# EAGLE design SolderIron2.0 (EAGLE 7.4.0)
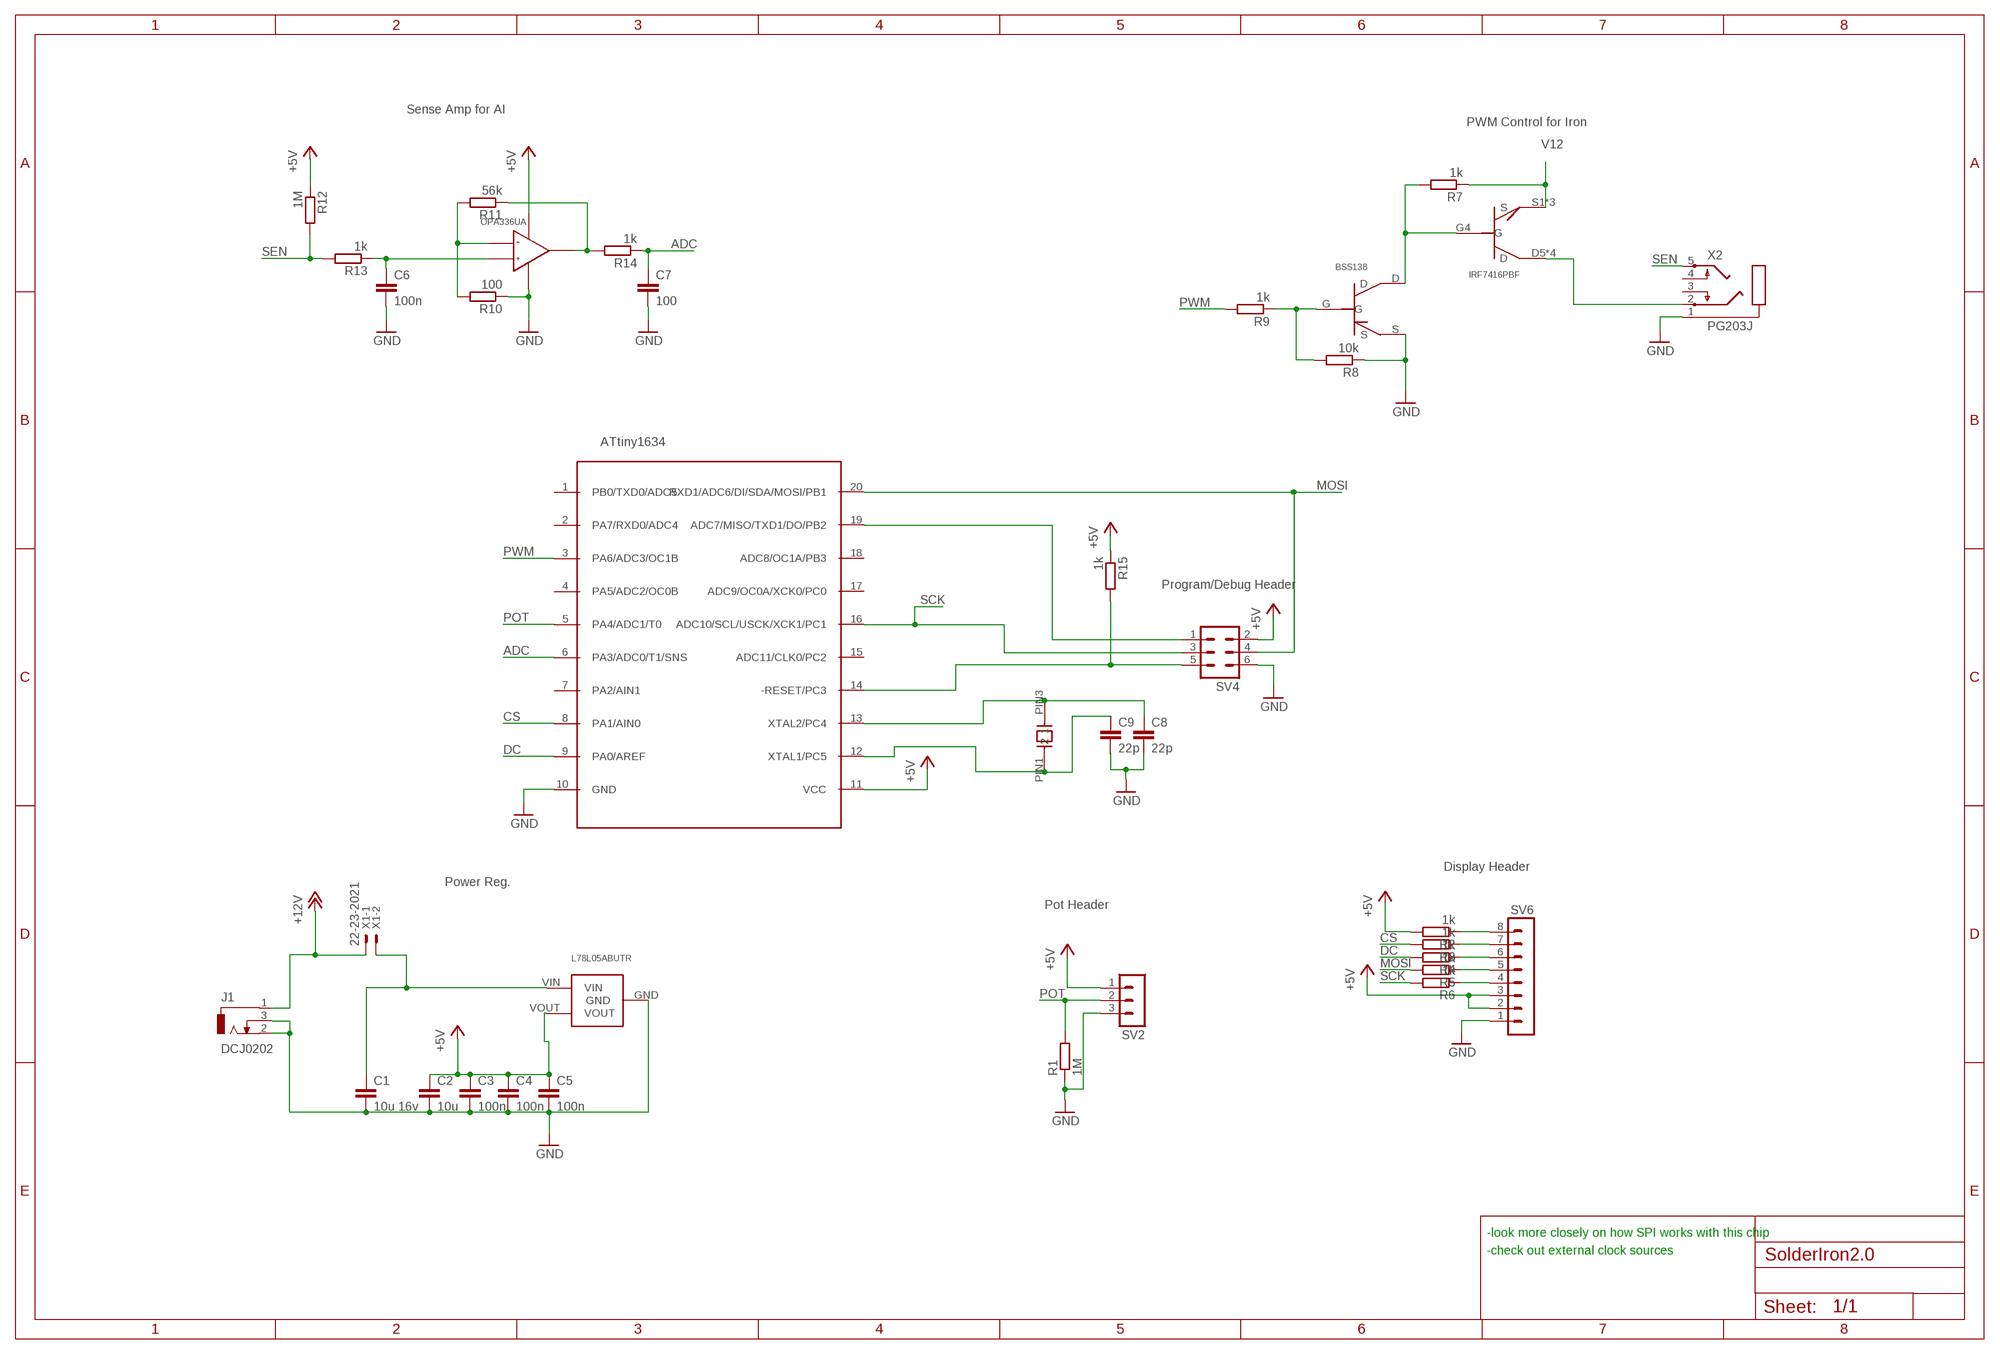
[diagram p0: schematic, sheet 1]

## Parts
C1  10u 16v  CC1206  [C1206]
C2  10u  CC1206  [C1206]
C3  100n  CC1206  [C1206]
C4  100n  CC1206  [C1206]
C5  100n  CC1206  [C1206]
C6  100n  CC1206  [C1206]
C7  100  CC1206  [C1206]
C8  22p  CC1206  [C1206]
C9  22p  CC1206  [C1206]
J1  DCJ0202  [POWERJACK2.1MM]
R1  1M  RR0603  [R0603]
R2  1k  RR0603  [R0603]
R3  1k  RR0603  [R0603]
R4  1k  RR0603  [R0603]
R5  1k  RR0603  [R0603]
R6  1k  RR0603  [R0603]
R7  1k  RR0603  [R0603]
R8  10k  RR0603  [R0603]
R9  1k  RR0603  [R0603]
R10  100  RR0603  [R0603]
R11  56k  RR0603  [R0603]
R12  1M  RR0603  [R0603]
R13  1k  RR0603  [R0603]
R14  1k  RR0603  [R0603]
R15  1k  RR0603  [R0603]
SV2  MA03-1  [MA03-1]
SV4  MA03-2  [MA03-2]
SV6  MA08-1  [MA08-1]
U$1  IRF7416PBF  [8-SOIC]
U$2  L78L05ABUTR  [SOT89-3]
U$3  BSS138  [SOT-23]
U$4  OPA336UA  [8-SOIC]
U$5  ATTINY1634  [SOIC20]
U$6  CX3225GB12000H0KPSC1  [4-SIZ]
X1  22-23-2021  [22-23-2021]
X2  PG203J  [PG203J]

## Nets
+5V: C2.1 C3.1 C4.1 C5.1 R2.2 R12.1 R15.1 SV2.1 SV4.2 SV6.2 SV6.3 U$2.VOUT U$4.D7(V+) U$5.11(VCC)
+12V: J1.1 X1.1
ADC: C7.1 R14.1 U$5.6(PA3/ADC0/T1/SNS)
CS: R3.2 U$5.8(PA1/AIN0)
DC: R4.2 U$5.9(PA0/AREF)
GND: C1.2 C2.2 C3.2 C4.2 C5.2 C6.2 C7.2 C8.2 C9.2 J1.2 J1.3 R1.1 R8.1 R10.1 SV2.3 SV4.6 SV6.1 U$2.GND U$3.S U$4.G4(V-) U$5.10(GND) X2.1
MOSI: R5.2 SV4.4 U$5.20(RXD1/ADC6/DI/SDA/MOSI/PB1)
N$1: C8.1 U$5.13(XTAL2/PC4) U$6.PIN3
N$2: R2.1 SV6.8
N$4: R3.1 SV6.7
N$5: R4.1 SV6.6
N$6: R5.1 SV6.5
N$7: R6.1 SV6.4
N$8: U$1.D5(D) U$1.D6(D) U$1.D7(D) U$1.D8(D) X2.2
N$9: R7.2 U$1.G4(G) U$3.D
N$10: R8.2 R9.1 U$3.G
N$11: R10.2 R11.2 U$4.S2(IN-)
N$12: R11.1 R14.2 U$4.D6(OUTPUT)
N$13: C6.1 R13.1 U$4.S3(IN+)
N$14: C9.1 U$5.12(XTAL1/PC5) U$6.PIN1
N$15: SV4.1 U$5.19(ADC7/MISO/TXD1/DO/PB2)
N$19: R15.2 SV4.5 U$5.14(-RESET/PC3)
POT: R1.2 SV2.2 U$5.5(PA4/ADC1/T0)
PWM: R9.2 U$5.3(PA6/ADC3/OC1B)
SCK: R6.2 SV4.3 U$5.16(ADC10/SCL/USCK/XCK1/PC1)
SEN: R12.2 R13.2 X2.5
V12: C1.1 R7.1 U$1.S1(S) U$1.S2(S) U$1.S3(S) U$2.VIN X1.2
Unconnected: U$5.1(PB0/TXD0/ADC5) U$5.2(PA7/RXD0/ADC4) U$5.4(PA5/ADC2/OC0B) U$5.7(PA2/AIN1) U$5.15(ADC11/CLK0/PC2) U$5.17(ADC9/OC0A/XCK0/PC0) U$5.18(ADC8/OC1A/PB3) X2.3 X2.4

## Notes on the sheet
- Sense Amp for AI
- PWM Control for Iron
- Program/Debug Header
- Display Header
- Power Reg.
- Pot Header
- -look more closely on how SPI works with this chip
- -check out external clock sources

## Library data of the parts
C1-C9 = eagle-ltspice:C: CAPACITOR, European symbol; SPICEMODEL: NONE; SPICEPREFIX: C
J1 = solderstation:DCJ0202: DC POWER JACK Source: DCJ0202.pdf
R1-R15 = eagle-ltspice:R: RESISTOR, European symbol; SPICEMODEL: NONE; SPICEPREFIX: R
SV2 = con-lstb:MA03-1: PIN HEADER; OC_FARNELL: unknown; OC_NEWARK: unknown
SV4 = con-lstb:MA03-2: PIN HEADER; OC_FARNELL: unknown; OC_NEWARK: unknown
SV6 = con-lstb:MA08-1: PIN HEADER; OC_FARNELL: unknown; OC_NEWARK: unknown
U$1 = solderstation:IRF7416PBF
U$2 = solderstation:L78L05ABUTR
U$3 = solderstation:BSS138
U$4 = solderstation:OPA336UA
U$5 = solderstation:ATTINY1634
U$6 = solderstation:CX3225GB12000H0KPSC1
X1 = con-molex:22-23-2021: .100" (2.54mm) Center Header - 2 Pin; MF: MOLEX; MPN: 22-23-2021; OC_FARNELL: 1462926; OC_NEWARK: 25C3832
X2 = solderstation:PG203J: MIC/HEADPHONE JACK KS-S stereo microphone/headphone jack PG203JN (Schukat); OC_FARNELL: unknown; OC_NEWARK: unknown

## Board
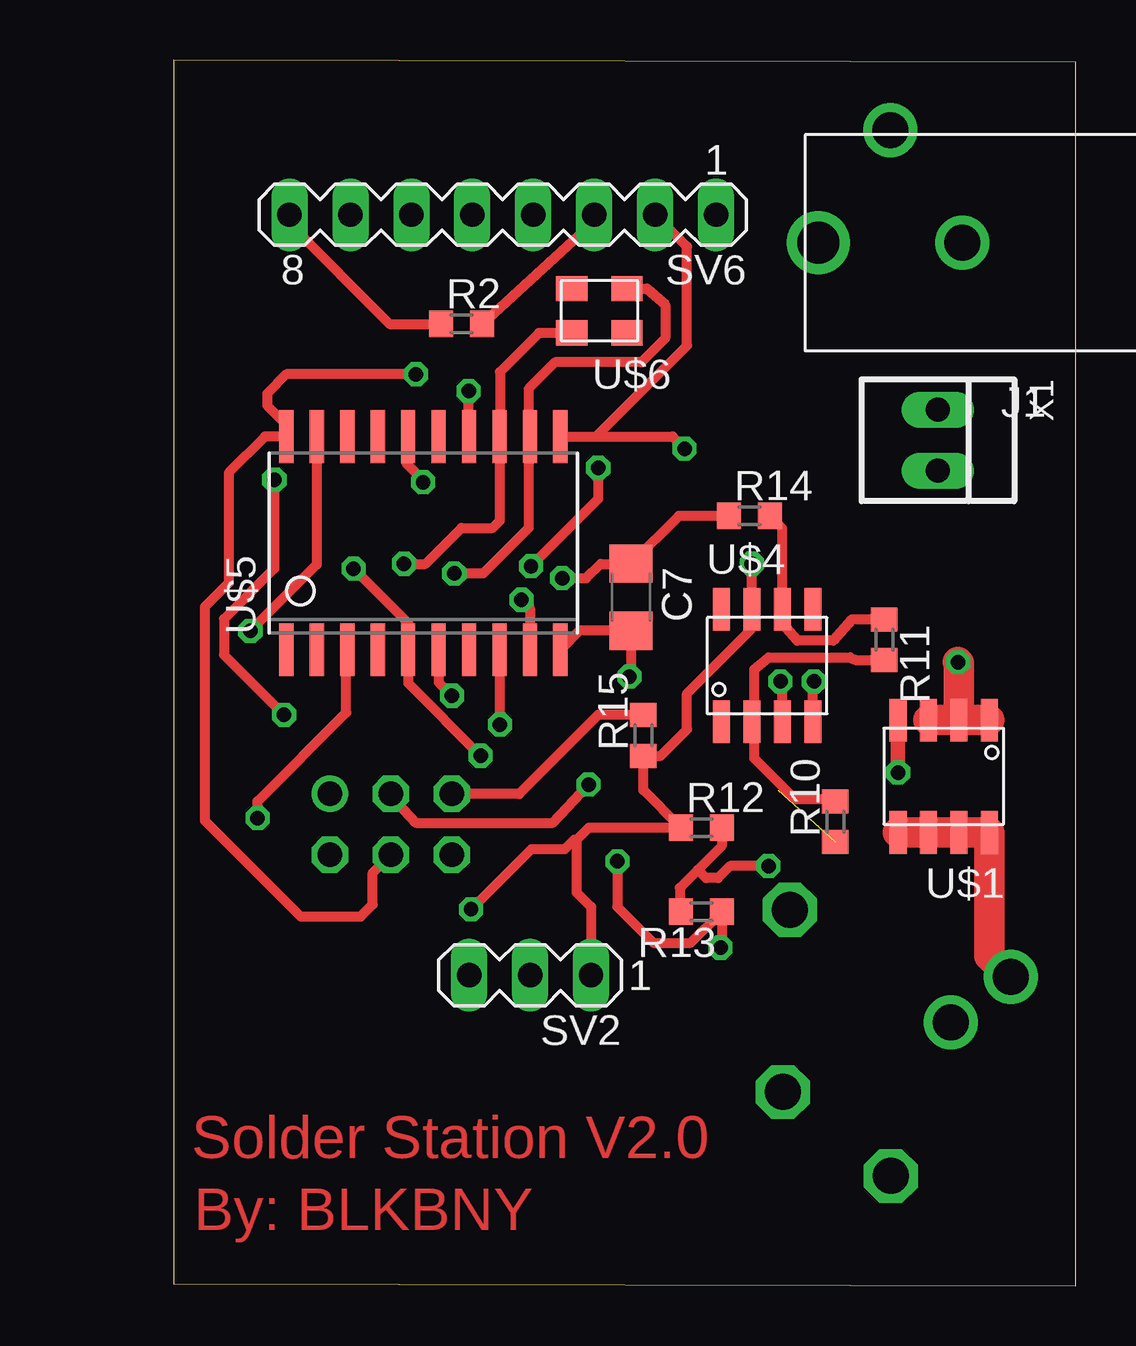
[diagram p1: board, top side]
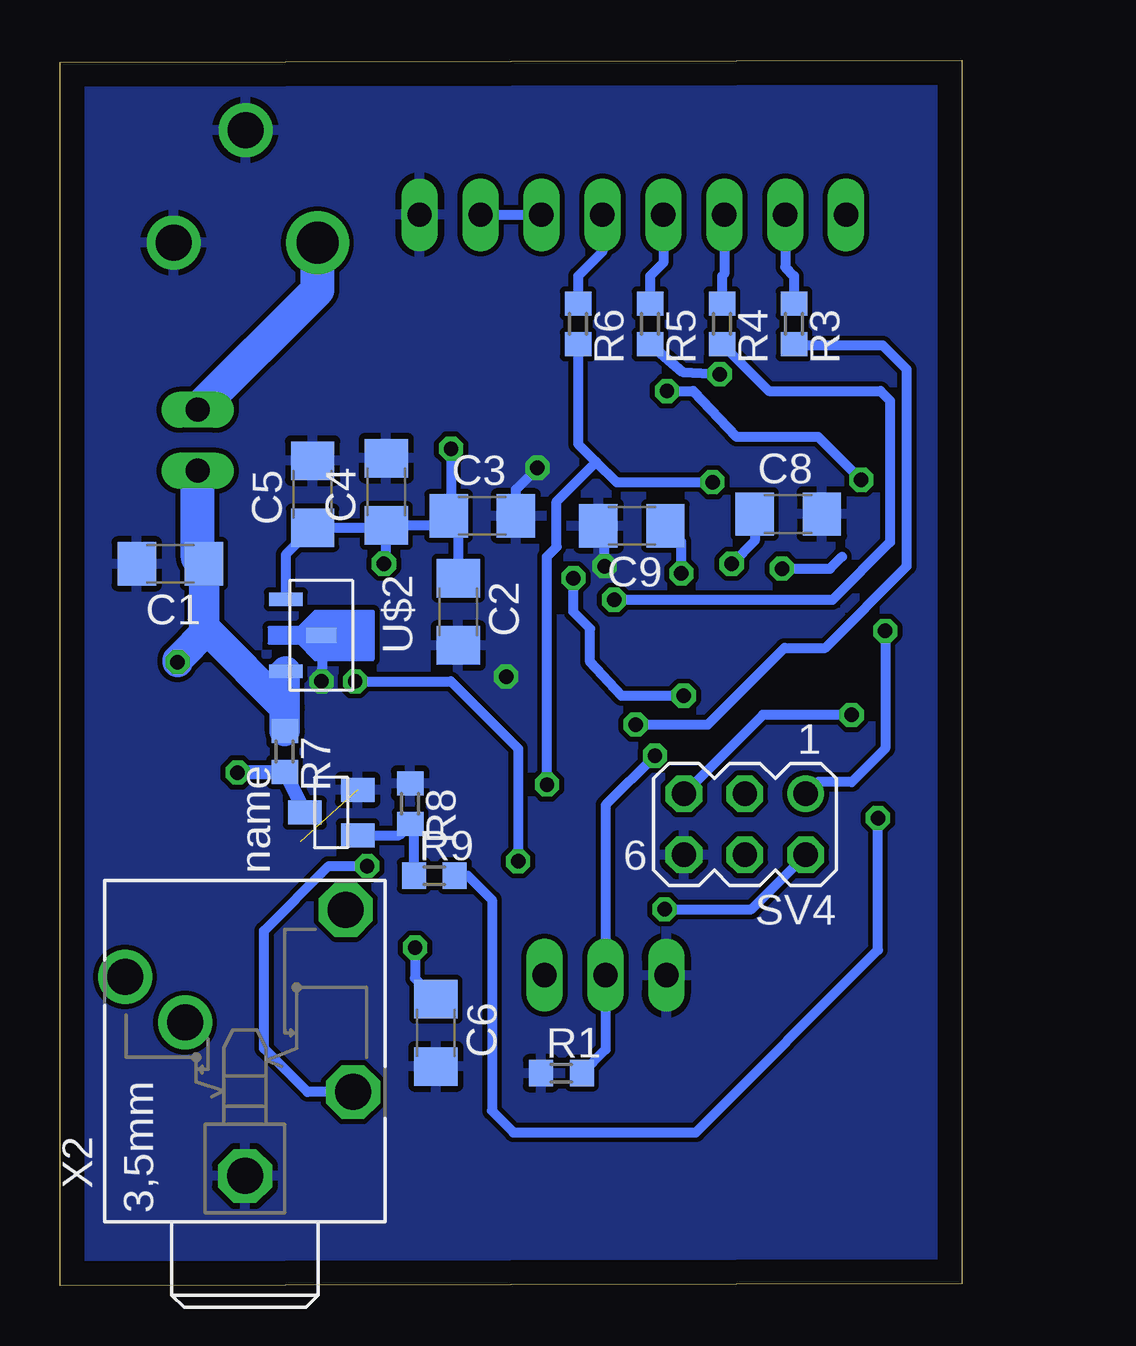
[diagram p2: board, bottom side, seen from below]

Size 37.6 x 51.1 mm. Coordinates in mm from the lower left corner, seen from the top.
Outline: 0,0.1 37.6,0 37.6,51 0,51.1 0,0.1
Copper layers (1*16): Top 0.035mm / dielectric 1.5mm / Bottom 0.035mm
Design rules "default *": minimum track width 10mil, minimum drill 8mil, track to track 8mil, track to pad 8mil, pad to pad 8mil, via to via 8mil, smd to smd 8mil, copper to edge 40mil, drill to drill 8mil, minimum pad ring 10mil, minimum via ring 8mil, stop-mask expansion 4mil, vias tented up to drill 0mil, thermal gap 10mil

### Footprints (pad centres in the part's own frame; a part is rotated, then mirrored left to right if it is on the bottom)
C1206 = smd 1.6 x 1.8: 1 -1.4,0; 2 1.4,0
POWERJACK2.1MM = drill 1.75: 1 6.5,0 | drill 1.5: 2 0.5,0; 3 3.5,-4.7
R0603 = smd 1 x 1.1: 1 -0.85,0; 2 0.85,0
MA03-1 = drill 1.016 long: 1 -2.54,0; 2 0,0; 3 2.54,0
MA03-2 = drill 1.016: 1 -2.54,-1.27 | drill 1.016 octagon: 2 -2.54,1.27; 3 0,-1.27; 4 0,1.27; 5 2.54,-1.27; 6 2.54,1.27
MA08-1 = drill 1.016 long: 1 -8.89,0; 2 -6.35,0; 3 -3.81,0; 4 -1.27,0; 5 1.27,0; 6 3.81,0; 7 6.35,0; 8 8.89,0
8-SOIC = smd 0.72 x 1.78: D5 1.905,2.34; D6 0.635,2.34; D7 -0.635,2.34; D8 -1.905,2.34; G4 1.905,-2.34; S1 -1.905,-2.34; S2 -0.635,-2.34; S3 0.635,-2.34
SOT89-3 = smd 0.635 x 1.27: GND 0,0 | smd 0.57 x 1.4: VIN 1.5,-1.475; VOUT -1.5,-1.475
SOT-23 = smd 1 x 1.4: D 0,1.1; G -0.95,-1.1; S 0.95,-1.1
SOIC20 = smd 0.6 x 2.2: 1 -1.905,-4.445; 2 -0.635,-4.445; 3 0.635,-4.445; 4 1.905,-4.445; 5 3.175,-4.445; 6 4.445,-4.445; 7 5.715,-4.445; 8 6.985,-4.445; 9 8.255,-4.445; 10 9.525,-4.445; 11 9.525,4.445; 12 8.255,4.445; 13 6.985,4.445; 14 5.715,4.445; 15 4.445,4.445; 16 3.175,4.445; 17 1.905,4.445; 18 0.635,4.445; 19 -0.635,4.445; 20 -1.905,4.445
4-SIZ = smd 1.3 x 1.05: PIN1 -1.15,-0.925; PIN2 1.15,-0.925; PIN3 1.15,0.925; PIN4 -1.15,0.925
22-23-2021 = drill 1 long: 1 -1.27,0; 2 1.27,0
PG203J = drill 1.499 octagon: 1 -5.2,0; 4 5.9,-4.2; 5 -1.7,-4.5 | drill 1.499: 2 3.1,5; 3 1.2,2.5

### Placement (x,y rotation side)
C1  33,30.1 180 bottom
C2  21,28.1 270 bottom
C3  20,32.1 0 bottom
C4  24,33.1 90 bottom
C5  27.07,33 90 bottom
C6  21.93,10.55 270 bottom
C7  19.07,28.71 270 top
C8  7.24,32.17 0 bottom
C9  13.76,31.68 180 bottom
J1  33.37,43.48 180 top
R1  16.7,8.87 0 bottom
R2  12,40.1 0 top
R3  7,40.1 270 bottom
R4  10,40.1 270 bottom
R5  13,40.1 270 bottom
R6  16,40.1 270 bottom
R7  28.23,22.28 270 bottom
R8  23,20.1 270 bottom
R9  22,17.1 0 bottom
R10  27.58,19.35 90 top
R11  29.62,26.93 270 top
R12  22,19.1 0 top
R13  22,15.6 180 top
R14  24,32.1 0 top
R15  19.58,22.95 90 top
SV2  14.86,12.95 180 top
SV4  9.05,19.24 180 bottom
SV6  13.72,44.65 180 top
U$1  32.1,21.24 180 top
U$2  26.71,27.12 270 bottom
U$3  26.29,19.73 90 bottom
U$4  24.74,25.86 0 top
U$5  6.6,30.96 0 top
U$6  17.75,40.65 180 top
X1  31.86,35.25 270 top
X2  29.89,9.78 90 bottom

### Tracks (layer width: path | path; a pad name or v marks a point on that pad's centre or on a via)
+5V  (via drill 0.6)
  Top 0.406: SV6.3 17.4,44.25 R2.2 | SV6.2 21.4,43.32 21.4,39.2 17.6,35.41 U$5.11 20.8,35.41 v21.3,34.9 | v24.1,30.1 24.1,28.3 U$4.D7 24.1,27.41 21.4,24.7 21.4,23.2 20.3,22.1 R15.1 19.58,20.67 R12.1 17.3,19.1 16.8,18.6 | 16.8,18.6 16.8,16.4 17.4,15.8 SV2.1 | 16.8,18.6 16.7,18.6 16.3,18.2 14.9,18.2 v12.4,15.7
  Bottom 0.406: SV6.2 SV6.3 | v21.3,34.9 21.3,32.2 C3.1 | C3.1 21,31.7 C2.1 | C3.1 21.8,31.7 C4.1 | C4.1 24.1,31.6 C5.1 28.19,30.48 U$2.VOUT | v24.1,30.1 24,30.2 C4.1 | v12.4,15.7 8.78,15.7 SV4.2
+12V
  Bottom 1.422: X1.1 26.87,41.51 J1.1
ADC  (via drill 0.6)
  Top 0.406: R14.1 21.06,32.1 C7.1 18.96,30 18.5,30 18.4,30.1 17.8,30.1 17.2,29.5 v16.2,29.5 | U$5.6 11.05,25.16 v11.6,24.6
  Bottom 0.406: v11.6,24.6 14.2,24.6 15.5,26 15.5,27.4 16.2,28.1 v16.2,29.5
CS  (via drill 0.6)
  Top 0.406: U$5.8 13.59,23.41 v13.6,23.4
  Bottom 0.406: v13.6,23.4 10.6,23.4 7.4,26.6 5.7,26.6 2.3,30 2.3,38.2 3.3,39.2 6.95,39.2 R3.2
DC  (via drill 0.6)
  Top 0.406: v14.5,28.6 14.86,28.25 U$5.9
  Bottom 0.406: R4.2 8.05,37.3 3.4,37.3 3,36.9 3,31 5.4,28.6 v14.5,28.6
GND  (via drill 0.6)  (1 unrouted)
  Top 0.406: U$5.10 16.92,27.31 C7.2 19.07,25.47 v19,25.4 | U$4.G4 26.65,25.05 v26.7,25.2 | v17.7,34.1 17.7,32.8 v14.9,30
  Bottom 0.406: v26.7,25.2 26.6,27.01 U$2.GND | C3.2 18.6,33.2 v17.7,34.1 | v14.9,30 14.9,31.42 C9.2
  pour Bottom: 1,51.1 38,51.1 arc-90 39,50.1 39,0.1 arc-90 38,-0.9 0,-0.9 arc-90 -1,0.1 -1,50.1 arc-90 0,51.1
MOSI  (via drill 0.6)
  Top 0.406: v10.1,38 4.7,38 3.9,37.2 3.9,36.7 4.7,35.91 U$5.20 3.8,35.41 2.3,33.9 2.3,29.3 1.3,28.3 1.3,19.4 5.3,15.4 7.8,15.4 8.3,15.9 8.3,17.22 SV4.4
  Bottom 0.406: R5.2 11.65,38.1 v10.1,38
N$1  (via drill 0.6)
  Top 0.406: U$6.PIN3 15.23,39.73 13.6,38.1 13.6,35.42 U$5.13 13.6,31.9 13.3,31.6 12,31.6 10.5,30.1 v9.6,30.1
  Bottom 0.406: C8.1 8.64,31.06 v9.6,30.1
N$2
  Top 0.406: SV6.8 4.83,44.27 9,40.1 R2.1
N$4
  Bottom 0.406: SV6.7 7.37,42.47 7,42.1 R3.1
N$5
  Bottom 0.406: SV6.6 9.91,42.19 10,42.1 R4.1
N$6
  Bottom 0.406: SV6.5 12.45,42.65 13,42.1 R5.1
N$7
  Bottom 0.406: SV6.4 14.99,43.11 16,42.1 R6.1
N$8
  Top 1.27: X2.2 34.01,13.76 U$1.D8 U$1.D7 U$1.D6 U$1.D5
N$9  (via drill 0.6)
  Top 0.61: v30.2,21.4 U$1.G4
  Bottom 0.61: v30.2,21.4 R7.2 U$3.D
N$10
  Bottom 0.406: U$3.G 23.47,18.78 R8.2 22.85,19.1 R9.1
N$11
  Top 0.406: 24.2,23.72 24.2,25.7 24.8,26.2 28.2,26.2 28.4,26.1 29.4,26.1 R11.2 | 24.2,23.72 U$4.S2 | 24.2,23.72 24.2,22 25.9,20.3 27.48,20.3 R10.2
N$12
  Top 0.406: R11.1 28.28,27.78 27.5,26.9 26,26.9 25.4,27.6 25.4,28.27 U$4.D6 25.38,31.58 R14.2
N$13  (via drill 0.6)
  Top 0.406: U$4.S3 25.38,24.98 v25.3,25.2 | v18.5,17.7 18.5,15.8 20,14.3 21.55,14.3 R13.1 22.85,14.15 v22.8,14.1
  Bottom 0.406: v25.3,25.2 21.3,25.2 18.5,22.4 v18.5,17.7 | v22.8,14.1 22.8,12.82 C6.1
N$14  (via drill 0.6)
  Top 0.406: U$6.PIN1 19.73,41.58 20.5,40.9 20.5,39.5 19.5,38.5 15.9,38.5 14.8,37.4 14.8,35.46 U$5.12 14.8,35.35 14.8,31.6 12.9,29.7 v11.7,29.7
  Bottom 0.406: v11.7,29.7 11.7,31.02 C9.1
N$15  (via drill 0.6)
  Top 0.406: U$5.19 5.96,30.07 v3.2,27.3
  Bottom 0.406: v3.2,27.3 3.2,22.4 4.6,21 6.02,21 SV4.1
N$19  (via drill 0.6)
  Top 0.406: R15.2 17.7,23.8 14.4,20.5 SV4.5 | U$5.14 12.3,35.42 v12.3,37.3 | v4.2,33.6 4.2,29.9 2.1,27.8 2.1,26.3 v4.6,23.8
  Bottom 0.406: v12.3,37.3 11.2,37.3 9.4,35.4 6,35.4 v4.2,33.6 | v4.6,23.8 8.3,23.8 SV4.5
POT  (via drill 0.6)
  Top 0.406: v7.5,29.9 9.77,27.62 U$5.5 9.77,25.12 v12.8,22.1
  Bottom 0.406: R1.2 14.86,9.86 SV2.2 14.86,20.04 v12.8,22.1 | v7.5,29.9 5.5,29.9 5,30.4
PWM  (via drill 0.6)
  Top 0.406: v3.5,19.5 3.5,20.2 7.2,23.9 7.2,26.48 U$5.3
  Bottom 0.406: R9.2 20.6,17.1 19.6,16.1 19.6,7.3 18.7,6.4 11.1,6.4 3.5,14 v3.5,19.5
SCK  (via drill 0.6)
  Top 0.406: v10.4,33.5 10.4,33.6 9.7,34.3 9.7,35.33 U$5.16 | SV4.3 9.05,20.45 10.1,19.3 15.8,19.3 v17.3,20.9
  Bottom 0.406: R6.2 16,35.1 15.25,34.35 | 15.25,34.35 14.4,33.5 v10.4,33.5 | v17.3,20.9 17.3,30.4 16.9,30.8 16.9,32.7 15.25,34.35
SEN  (via drill 0.6)
  Top 0.406: R12.2 22.85,18.35 21.85,17.35 | 21.85,17.35 21.1,16.6 21.1,15.65 R13.2 | v24.8,17.5 23.2,17.5 22.7,17 22.2,17 21.85,17.35
  Bottom 0.406: X2.5 27.28,8.08 29.1,9.9 29.1,14.8 26.4,17.5 v24.8,17.5
V12  (via drill 0.6)
  Top 1.27: U$1.S2 32.73,25.97 v32.7,26 | U$1.S3 U$1.S2 | U$1.S2 U$1.S1
  Bottom 0.406: C1.1 31.86,30.36
  Bottom 1.27: R7.1 28.23,24.1 | 28.23,24.1 28.23,25.58 U$2.VIN | C1.1 31.6,27.47 31.47,27.34 | 31.47,27.34 28.23,24.1 | v32.7,26 32.7,26.1 31.47,27.34
  Bottom 1.422: 31.86,30.36 X1.2

### Text on the board
Top: Solder Station V2.0 | By: BLKBNY